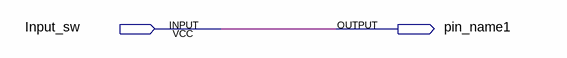
[diagram p0: schematic sheet]
// Quartus schematic blockEd.bdf as structural Verilog: 0 symbols, 2 pins
module blockEd (
  input  Input_sw,
  output pin_name1
);


  assign pin_name1 = Input_sw;
endmodule
